# Altium schematic sheet LED.SchDoc
size A4
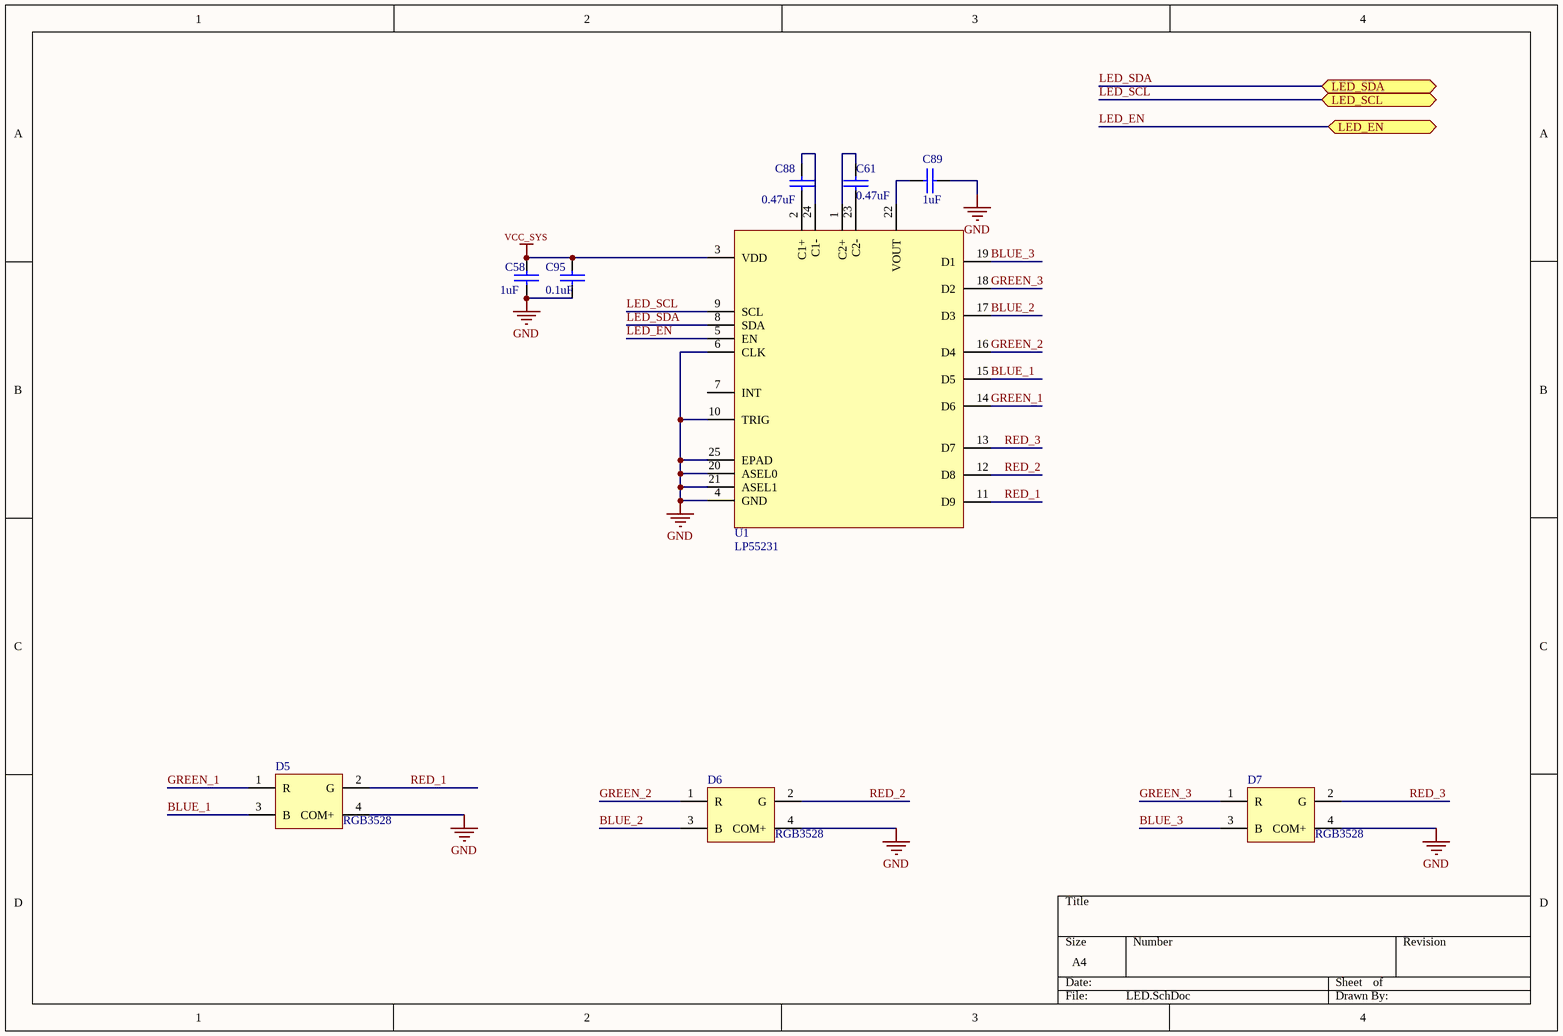
[diagram p0: LED.SchDoc]

## Parts
C58  1uF  [0402C]
C61  0.47uF  [0402C]
C88  0.47uF  [0402C]
C89  1uF  [0402C]
C95  0.1uF  [0402C]
D5  RGB3528  [19-237B/R6GHBHC-C01/2T]
D6  RGB3528  [19-237B/R6GHBHC-C01/2T]
D7  RGB3528  [19-237B/R6GHBHC-C01/2T]
U1  LP55231  [WQFN24]

## Ports
LED_EN, LED_SCL, LED_SDA

## Nets
GND: C58.2 C89.1 C95.2 D5.4(COM+) D6.4(COM+) D7.4(COM+) U1.4(GND) U1.6(CLK) U1.10(TRIG) U1.20(ASEL0) U1.21(ASEL1) U1.25(EPAD)
VCC_SYS: C58.1 C95.1 U1.3(VDD)
BLUE_1: D5.3(B) U1.15(D5)
BLUE_2: D6.3(B) U1.17(D3)
BLUE_3: D7.3(B) U1.19(D1)
GREEN_1: D5.1(R) U1.14(D6)
GREEN_2: D6.1(R) U1.16(D4)
GREEN_3: D7.1(R) U1.18(D2)
LED_EN: U1.5(EN) ; port LED_EN
LED_SCL: U1.9(SCL) ; port LED_SCL
LED_SDA: U1.8(SDA) ; port LED_SDA
RED_1: D5.2(G) U1.11(D9)
RED_2: D6.2(G) U1.12(D8)
RED_3: D7.2(G) U1.13(D7)
NetC61_1: C61.1 U1.1(C2+)
NetC61_2: C61.2 U1.23(C2-)
NetC88_1: C88.1 U1.2(C1+)
NetC88_2: C88.2 U1.24(C1-)
NetC89_2: C89.2 U1.22(VOUT)

Not connected (* = marked no-connect by the designer): U1 7(INT)

## Library data of the parts
C58 = CAP: 1uF/10V/X7R/10%，0402
C61 C95 = CAP: 0.1uF/10V/X7R/10%，0402
C88 C89 = CAP: 0.22uF/10V/X7R/10%，0402
U1 = SN3199: 厂家：SI-EN，型号：IS31FL3199-QFLS2-TR
D5-D7 = RGB3528: Published: 24-Mar-1999; LatestRevisionDate: 17-Jul-2002; LatestRevisionNote: Re-released for DXP Platform.; PackageReference: D-46_6A; Publisher: Altium Limited; PackageDescription: Bridge Rectifier; 4 Terminals; Body 16.8 x 16.8 mm (typ); Pitch 10.67 mm